# EAGLE design buttons (EAGLE 6.5.0)
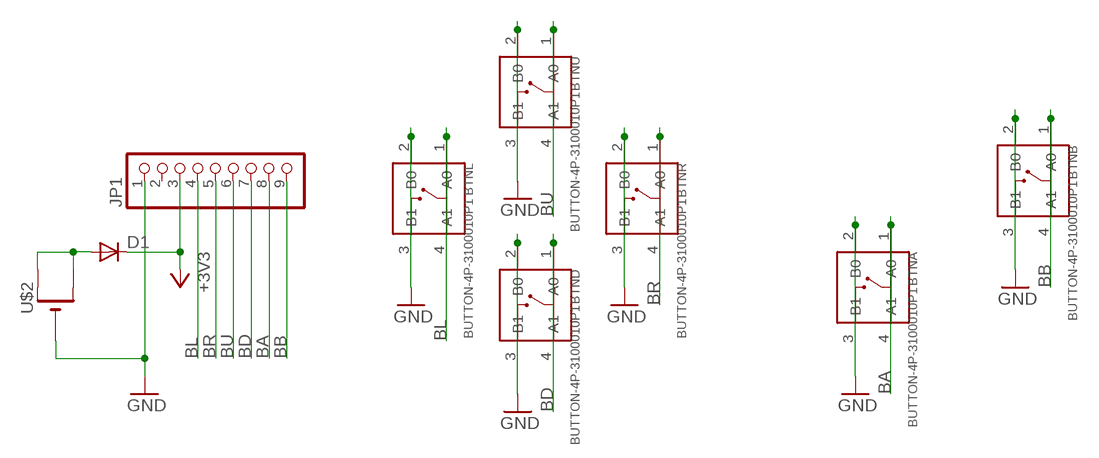
[diagram p0: schematic, sheet 1]

## Parts
BTNA  BUTTON-4P-3100010P1  [4P-SMD-6.0X6.0X5.0H]
BTNB  BUTTON-4P-3100010P1  [4P-SMD-6.0X6.0X5.0H]
BTND  BUTTON-4P-3100010P1  [4P-SMD-6.0X6.0X5.0H]
BTNL  BUTTON-4P-3100010P1  [4P-SMD-6.0X6.0X5.0H]
BTNR  BUTTON-4P-3100010P1  [4P-SMD-6.0X6.0X5.0H]
BTNU  BUTTON-4P-3100010P1  [4P-SMD-6.0X6.0X5.0H]
D1  DIODE-SOD323-W  [SOD323-W]
JP1  PINHD-1X9  [1X09]
U$2  CR2032SMT  [CR2032-SMD]

## Nets
+3V3: D1.C JP1.3
BA: BTNA.1(A0) BTNA.4(A1) JP1.8
BB: BTNB.1(A0) BTNB.4(A1) JP1.9
BD: BTND.1(A0) BTND.4(A1) JP1.7
BL: BTNL.1(A0) BTNL.4(A1) JP1.4
BR: BTNR.1(A0) BTNR.4(A1) JP1.5
BU: BTNU.1(A0) BTNU.4(A1) JP1.6
GND: BTNA.2(B0) BTNA.3(B1) BTNB.2(B0) BTNB.3(B1) BTND.2(B0) BTND.3(B1) BTNL.2(B0) BTNL.3(B1) BTNR.2(B0) BTNR.3(B1) BTNU.2(B0) BTNU.3(B1) JP1.1 U$2.-
N$3: D1.A U$2.+$1(+) U$2.+$2(+1)
Unconnected: JP1.2

## Library data of the parts
BTNA BTNB BTND BTNL BTNR BTNU = OPL Eagle Library:BUTTON-4P
D1 = diode:DIODE-: DIODE
JP1 = pinhead:PINHD-1X9: PIN HEADER
U$2 = adafruit:CR2032

## Net classes
0 default: width 0.305 mm

## Board
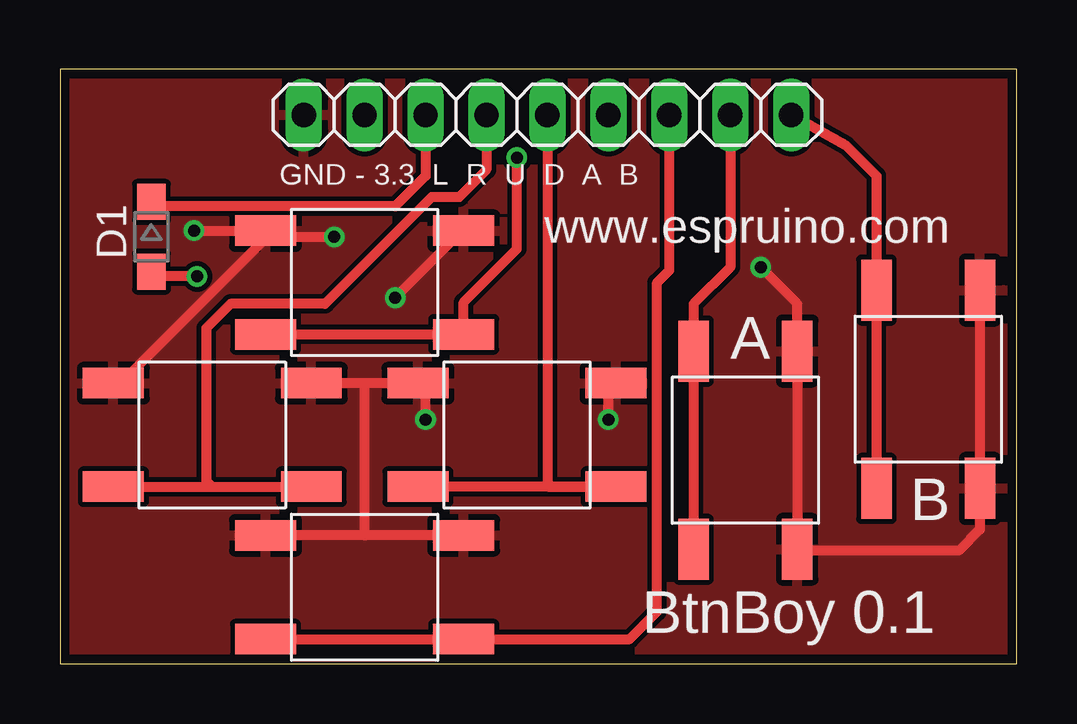
[diagram p1: board, top side]
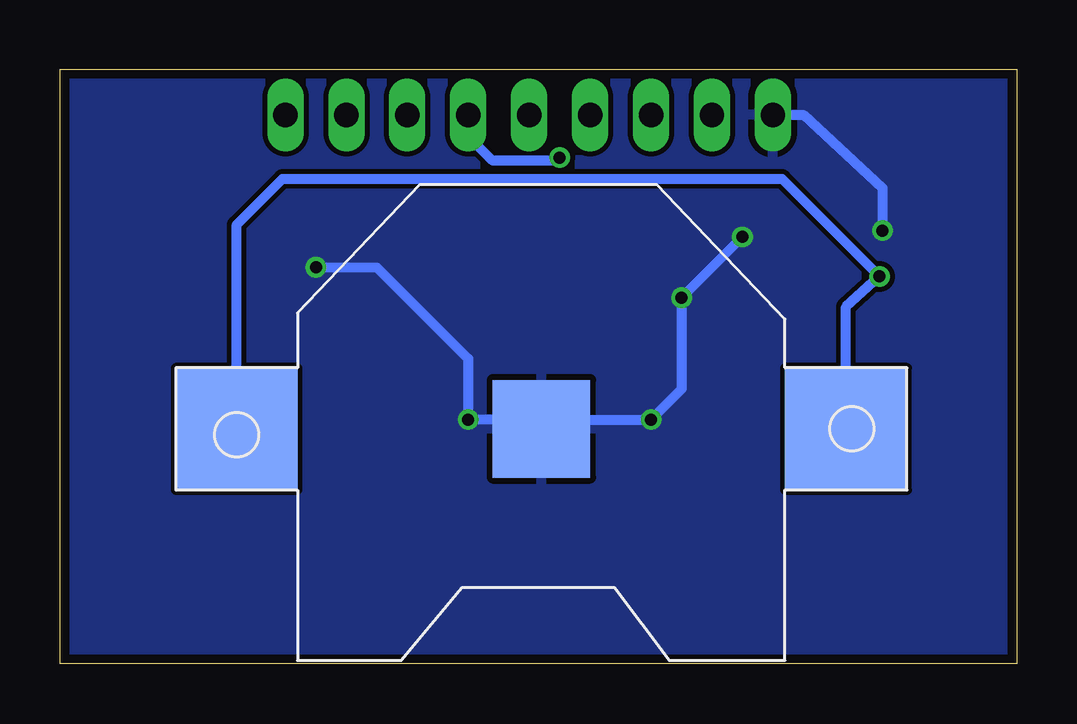
[diagram p2: board, bottom side, seen from below]

Size 39.88 x 24.77 mm. Coordinates in mm from the lower left corner, seen from the top.
Outline: 0,0 39.88,0 39.88,24.77 0,24.77 0,0
Copper layers (1*16): Top 0.0356mm / dielectric 1.5011mm / Bottom 0.0356mm
Design rules "oshpark *": minimum track width 10mil, minimum drill 13mil, track to track 8mil, track to pad 6mil, pad to pad 6mil, via to via 6mil, smd to smd 6mil, copper to edge 15mil, drill to drill 6mil, minimum pad ring 7mil, minimum via ring 7mil, stop-mask expansion 4mil, vias tented up to drill 20mil, thermal gap 10mil

### Footprints (pad centres in the part's own frame; a part is rotated, then mirrored left to right if it is on the bottom)
4P-SMD-6.0X6.0X5.0H = smd 2.54 x 1.27: 1 -4.129,2.159; 2 -4.129,-2.159; 3 4.129,-2.159; 4 4.129,2.159
SOD323-W = smd 1.5 x 1.2: A 1.45,0; C -1.45,0
1X09 = drill 1.016 long: 1 -10.16,0; 2 -7.62,0; 3 -5.08,0; 4 -2.54,0; 5 0,0; 6 2.54,0; 7 5.08,0; 8 7.62,0; 9 10.16,0
CR2032-SMD = smd 5.08 x 5.08: +$1 -12.7,0; +$2 12.7,0 | smd 4.064 x 4.064: - 0,0

### Placement (x,y rotation side)
BTNA  28.57,8.89 90 top
BTNB  36.2,11.43 90 top
BTND  12.7,3.17 180 top
BTNL  6.35,9.53 180 top
BTNR  19.05,9.53 180 top
BTNU  12.7,15.88 180 top
D1  3.81,17.78 270 top
JP1  20.32,22.86 0 top
U$2  19.81,9.78 180 bottom

### Tracks (layer width: path | path; a pad name or v marks a point on that pad's centre or on a via)
+3V3
  Top 0.406: JP1.3 15.24,20.32 13.97,19.05 3.99,19.05 D1.C
BA
  Top 0.406: JP1.8 27.94,16.51 26.42,14.99 BTNA.4 BTNA.1
BB
  Top 0.406: JP1.9 32.77,21.59 34.04,20.32 BTNB.4 BTNB.1
BD
  Top 0.406: BTND.4 BTND.1 23.75,1.02 24.89,2.16 24.89,15.88 25.4,16.38 JP1.7
BL
  Top 0.406: BTNL.4 6.35,7.37 | 6.35,7.37 BTNL.1 | JP1.4 17.78,20.57 16.64,19.43 15.49,19.43 11.05,14.99 7.11,14.99 6.1,13.97 6.1,7.62 6.35,7.37
BR
  Top 0.406: JP1.5 20.32,7.37 BTNR.1 BTNR.4
BU  (via drill 0.5)
  Top 0.406: BTNU.4 BTNU.1 16.83,15.05 19.05,17.27 v19.05,21.08
  Bottom 0.406: v19.05,21.08 19.3,20.95 21.84,20.95 22.86,21.97 JP1.6
GND  (via drill 0.5)
  Top 0.406: 12.7,11.68 BTNR.3 15.24,11.37 v15.24,10.16 | 12.7,11.68 BTNL.2 | 12.7,5.33 BTND.3 | BTND.2 12.7,5.33 | 12.7,5.33 12.7,11.68 | v5.59,18.03 BTNU.3 8.57,17.71 | 8.57,17.71 2.79,11.94 2.48,11.94 BTNL.3 | BTNB.3 BTNB.2 38.35,5.59 37.47,4.7 30.8,4.7 BTNA.2 BTNA.3 30.73,14.99 v29.21,16.51 | v22.86,10.16 22.86,11.37 BTNR.2 | BTNU.2 16.76,18.03 v13.97,15.24 | 8.57,17.71 8.82,17.71 8.96,17.71 8.89,17.78 v11.43,17.78
  Bottom 0.406: JP1.1 8.89,22.86 5.59,19.81 v5.59,18.03 | v29.21,16.51 26.67,16.51 22.86,12.7 v22.86,10.16 20.32,10.16 U$2.- 19.43,9.78 19.05,10.16 v15.24,10.16 13.97,11.43 v13.97,15.24 v11.43,17.78
  pour Bottom: 0,24.77 40.64,24.77 40.64,0 0,0
  pour Top: 0,24.77 40.64,24.77 40.64,0 0,0
N$3  (via drill 0.5)
  Top 0.406: v5.71,16.13 4.01,16.13 D1.A
  Bottom 0.406: U$2.+$1 7.11,14.86 v5.71,16.13 9.78,20.19 30.61,20.19 32.51,18.29 U$2.+$2

### Text on the board
tNames: GND - 3.3 L R U D A B | www.espruino.com | A | B | BtnBoy 0.1